# EAGLE schematic IR Sensor (EAGLE 9.6.2)
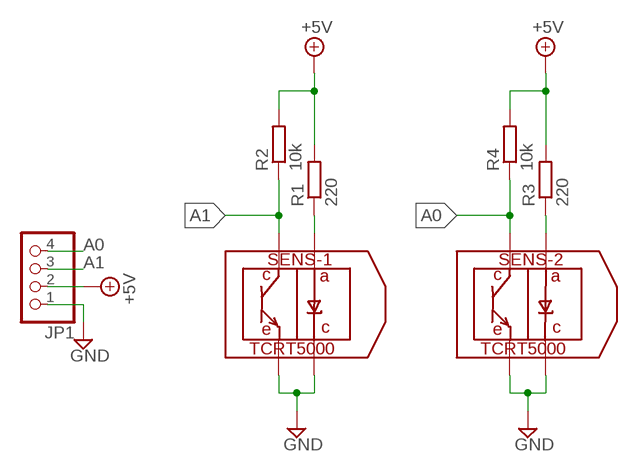
[diagram p0: schematic, sheet 1]

## Parts
JP1  PINHD-1X4/90  [1X04/90]
R1  220  R-EU_0204/7  [0204/7]
R2  10k  R-EU_0204/7  [0204/7]
R3  220  R-EU_0204/7  [0204/7]
R4  10k  R-EU_0204/7  [0204/7]
SENS-1  TCRT5000  [5000]
SENS-2  TCRT5000  [5000]

## Nets
+5V: JP1.2 R1.2 R2.2 R3.2 R4.2
A0: JP1.4 R4.1 SENS-2.P$1
A1: JP1.3 R2.1 SENS-1.P$1
GND: JP1.1 SENS-1.P$2 SENS-1.P$4 SENS-2.P$2 SENS-2.P$4
N$1: R1.1 SENS-1.P$3
N$2: R3.1 SENS-2.P$3

## Library data of the parts
JP1 = pinhead:PINHD-1X4: PIN HEADER
R1-R4 = rcl:R-EU_: RESISTOR, European symbol; SPICEPREFIX: R
SENS-1 SENS-2 = IR Sensors:TCRT5000: Reflective Optical Sensor with Transistor Output. Vishay Semiconductors